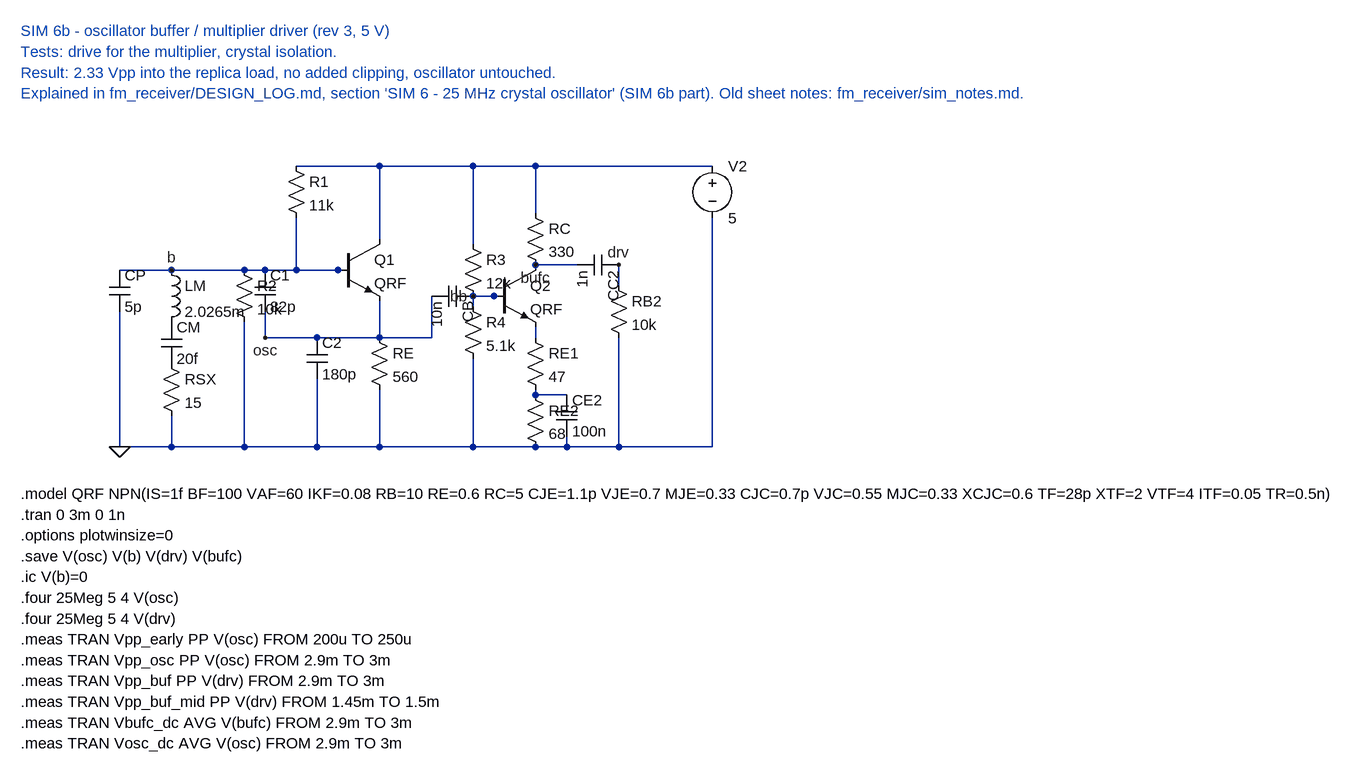
[diagram p0: schematic sim6b_osc_buffer.asc]
sim6b_osc_buffer.asc, the LTspice schematic file:
Version 4
SHEET 1 1400 780
WIRE 304 176 224 176
WIRE 416 176 304 176
WIRE 448 176 416 176
WIRE 496 176 448 176
WIRE 576 176 496 176
WIRE 624 128 624 16
WIRE 496 16 624 16
WIRE 624 16 768 16
WIRE 768 16 864 16
WIRE 864 16 1136 16
WIRE 496 96 496 176
WIRE 448 240 448 280
WIRE 528 280 448 280
WIRE 624 280 528 280
WIRE 624 224 624 280
WIRE 624 280 704 280
WIRE 704 280 704 216
WIRE 768 216 816 216
WIRE 768 216 768 232
WIRE 768 136 768 16
WIRE 768 312 768 448
WIRE 864 88 864 16
WIRE 864 168 928 168
WIRE 864 264 864 280
WIRE 864 360 864 368
WIRE 864 368 912 368
WIRE 912 432 912 448
WIRE 992 168 992 200
WIRE 992 280 992 448
WIRE 224 240 224 448
WIRE 304 400 304 448
WIRE 416 256 416 448
WIRE 528 344 528 448
WIRE 624 360 624 448
WIRE 1136 96 1136 448
WIRE 304 448 224 448
WIRE 416 448 304 448
WIRE 528 448 416 448
WIRE 624 448 528 448
WIRE 768 448 624 448
WIRE 864 448 768 448
WIRE 912 448 864 448
WIRE 992 448 912 448
WIRE 1136 448 992 448
FLAG 224 448 0
FLAG 448 280 osc
FLAG 304 176 b
FLAG 768 216 bb
FLAG 864 168 bufc
FLAG 992 168 drv
SYMBOL voltage 1136 0 R0
SYMATTR InstName V2
SYMATTR Value 5
SYMBOL res 480 0 R0
SYMATTR InstName R1
SYMATTR Value 11k
SYMBOL res 400 160 R0
SYMATTR InstName R2
SYMATTR Value 10k
SYMBOL npn 560 128 R0
SYMATTR InstName Q1
SYMATTR Value QRF
SYMBOL ind 288 160 R0
SYMATTR InstName LM
SYMATTR Value 2.0265m
SYMBOL cap 288 256 R0
SYMATTR InstName CM
SYMATTR Value 20f
SYMBOL res 288 304 R0
SYMATTR InstName RSX
SYMATTR Value 15
SYMBOL cap 208 176 R0
SYMATTR InstName CP
SYMATTR Value 5p
SYMBOL cap 432 176 R0
SYMATTR InstName C1
SYMATTR Value 82p
SYMBOL cap 512 280 R0
SYMATTR InstName C2
SYMATTR Value 180p
SYMBOL res 608 264 R0
SYMATTR InstName RE
SYMATTR Value 560
SYMBOL cap 768 200 R90
SYMATTR InstName CB
SYMATTR Value 10n
SYMBOL res 752 120 R0
SYMATTR InstName R3
SYMATTR Value 12k
SYMBOL res 752 216 R0
SYMATTR InstName R4
SYMATTR Value 5.1k
SYMBOL npn 800 168 R0
SYMATTR InstName Q2
SYMATTR Value QRF
SYMBOL res 848 72 R0
SYMATTR InstName RC
SYMATTR Value 330
SYMBOL res 848 264 R0
SYMATTR InstName RE1
SYMATTR Value 47
SYMBOL res 848 352 R0
SYMATTR InstName RE2
SYMATTR Value 68
SYMBOL cap 896 368 R0
SYMATTR InstName CE2
SYMATTR Value 100n
SYMBOL cap 992 152 R90
SYMATTR InstName CC2
SYMATTR Value 1n
SYMBOL res 976 184 R0
SYMATTR InstName RB2
SYMATTR Value 10k
TEXT 72 520 Left 2 !.model QRF NPN(IS=1f BF=100 VAF=60 IKF=0.08 RB=10 RE=0.6 RC=5 CJE=1.1p VJE=0.7 MJE=0.33 CJC=0.7p VJC=0.55 MJC=0.33 XCJC=0.6 TF=28p XTF=2 VTF=4 ITF=0.05 TR=0.5n)
TEXT 72 552 Left 2 !.tran 0 3m 0 1n
TEXT 72 584 Left 2 !.options plotwinsize=0
TEXT 72 616 Left 2 !.save V(osc) V(b) V(drv) V(bufc)
TEXT 72 648 Left 2 !.ic V(b)=0
TEXT 72 680 Left 2 !.four 25Meg 5 4 V(osc)
TEXT 72 712 Left 2 !.four 25Meg 5 4 V(drv)
TEXT 72 744 Left 2 !.meas TRAN Vpp_early PP V(osc) FROM 200u TO 250u
TEXT 72 776 Left 2 !.meas TRAN Vpp_osc PP V(osc) FROM 2.9m TO 3m
TEXT 72 808 Left 2 !.meas TRAN Vpp_buf PP V(drv) FROM 2.9m TO 3m
TEXT 72 840 Left 2 !.meas TRAN Vpp_buf_mid PP V(drv) FROM 1.45m TO 1.5m
TEXT 72 872 Left 2 !.meas TRAN Vbufc_dc AVG V(bufc) FROM 2.9m TO 3m
TEXT 72 904 Left 2 !.meas TRAN Vosc_dc AVG V(osc) FROM 2.9m TO 3m
TEXT 72 -192 Left 2 ;SIM 6b - oscillator buffer / multiplier driver (rev 3, 5 V)
TEXT 72 -160 Left 2 ;Tests: drive for the multiplier, crystal isolation.
TEXT 72 -128 Left 2 ;Result: 2.33 Vpp into the replica load, no added clipping, oscillator untouched.
TEXT 72 -96 Left 2 ;Explained in fm_receiver/DESIGN_LOG.md, section 'SIM 6 - 25 MHz crystal oscillator' (SIM 6b part). Old sheet notes: fm_receiver/sim_notes.md.

The netlist it stands for:
* sim6b_osc_buffer.asc
V2 N001 0 5
R1 N001 b 11k
R2 b 0 10k
Q1 N001 b osc 0 QRF
LM b P001 2.0265m
CM P001 P002 20f
RSX P002 0 15
CP b 0 5p
C1 b osc 82p
C2 osc 0 180p
RE osc 0 560
CB bb osc 10n
R3 N001 bb 12k
R4 bb 0 5.1k
Q2 bufc bb N002 0 QRF
RC N001 bufc 330
RE1 N002 N003 47
RE2 N003 0 68
CE2 N003 0 100n
CC2 drv bufc 1n
RB2 drv 0 10k
.model NPN NPN
.model PNP PNP
.lib standard.bjt
.model QRF NPN(IS=1f BF=100 VAF=60 IKF=0.08 RB=10 RE=0.6 RC=5 CJE=1.1p VJE=0.7 MJE=0.33 CJC=0.7p VJC=0.55 MJC=0.33 XCJC=0.6 TF=28p XTF=2 VTF=4 ITF=0.05 TR=0.5n)
.tran 0 3m 0 1n
.options plotwinsize=0
.save V(osc) V(b) V(drv) V(bufc)
.ic V(b)=0
.four 25Meg 5 4 V(osc)
.four 25Meg 5 4 V(drv)
.meas TRAN Vpp_early PP V(osc) FROM 200u TO 250u
.meas TRAN Vpp_osc PP V(osc) FROM 2.9m TO 3m
.meas TRAN Vpp_buf PP V(drv) FROM 2.9m TO 3m
.meas TRAN Vpp_buf_mid PP V(drv) FROM 1.45m TO 1.5m
.meas TRAN Vbufc_dc AVG V(bufc) FROM 2.9m TO 3m
.meas TRAN Vosc_dc AVG V(osc) FROM 2.9m TO 3m
* SIM 6b - oscillator buffer / multiplier driver (rev 3, 5 V)
* Tests: drive for the multiplier, crystal isolation.
* Result: 2.33 Vpp into the replica load, no added clipping, oscillator untouched.
* Explained in fm_receiver/DESIGN_LOG.md, section 'SIM 6 - 25 MHz crystal oscillator' (SIM 6b part). Old sheet notes: fm_receiver/sim_notes.md.
.backanno
.end